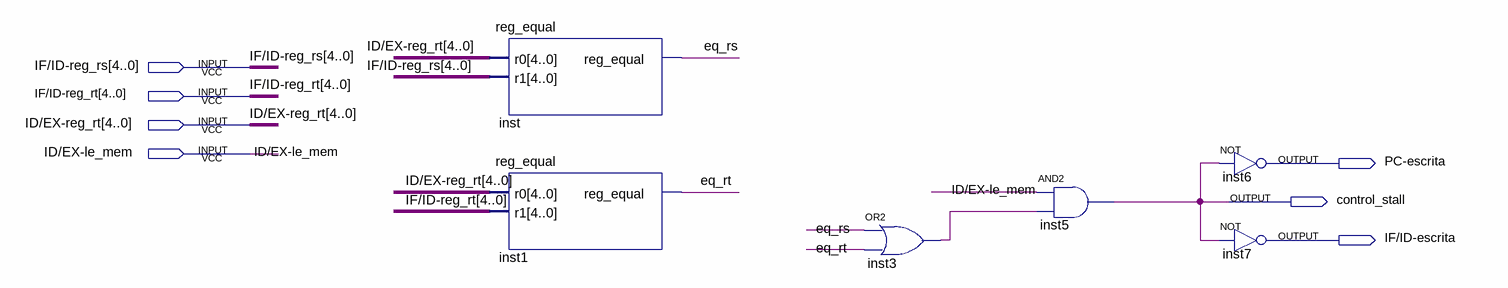
[diagram p0: schematic sheet]
// Quartus schematic hazard.bdf as structural Verilog: 6 symbols, 7 pins
module hazard (
  input  [4:0] \IF/ID-reg_rs ,
  input  [4:0] \IF/ID-reg_rt ,
  input  [4:0] \ID/EX-reg_rt ,
  input  \ID/EX-le_mem ,
  output \PC-escrita ,
  output control_stall,
  output \IF/ID-escrita 
);

  wire eq_rs, eq_rt, inst3_out;

  reg_equal inst (.r0(\ID/EX-reg_rt ), .r1(\IF/ID-reg_rs ), .reg_equal(eq_rs));
  reg_equal inst1 (.r0(\ID/EX-reg_rt ), .r1(\IF/ID-reg_rt ), .reg_equal(eq_rt));
  or inst3 (inst3_out, eq_rs, eq_rt);
  and inst5 (control_stall, \ID/EX-le_mem , inst3_out);
  not inst6 (\PC-escrita , control_stall);
  not inst7 (\IF/ID-escrita , control_stall);
endmodule
